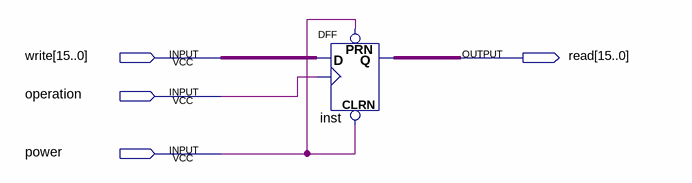
[diagram p0: schematic sheet]
// Quartus schematic 16bit_register_1part.bdf as structural Verilog: 1 symbols, 4 pins
module \16bit_register_1part  (
  input  [15:0] write,
  input  operation,
  input  power,
  output [15:0] read
);

  DFF inst[15:0] (.CLRN(power), .CLK(operation), .D(write), .PRN(power), .Q(read));
endmodule
